# Altium schematic sheet [3] ADC.SchDoc
size A4; DocumentNumber: 4; SheetNumber: 4; SheetTotal: 4
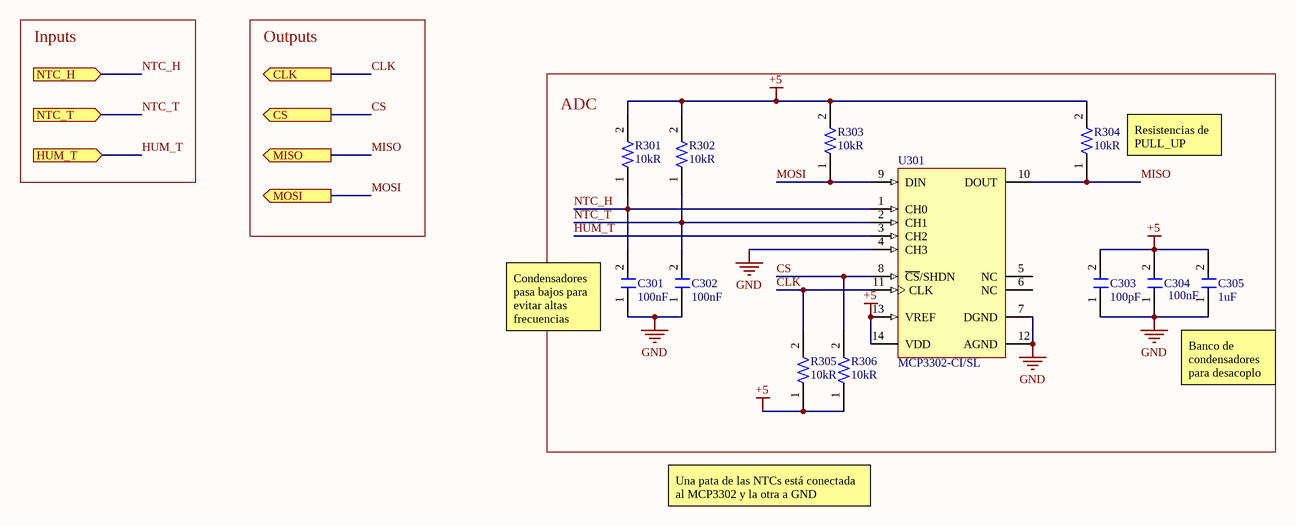
[diagram p0: [3] ADC.SchDoc]

## Parts
C301  Capacitance: 100nF  [C1206FNPC-RW]  (hidden comment: 885012208058)
C302  Capacitance: 100nF  [C1206FNPC-RW]  (hidden comment: 885012208058)
C303  Capacitance: 100pF  [C0805FNPC-W]  (hidden comment: 885012007057)
C304  Capacitance: 100nF  [C1206FNPC-RW]  (hidden comment: 885012208058)
C305  Capacitance: 1uF  [C1206FNPC-RW]  (hidden comment: 885012208036)
R301  Resistance: 10kR  [R1206FTK-W]  (hidden comment: CRCW120610K0FKEA)
R302  Resistance: 10kR  [R1206FTK-W]  (hidden comment: CRCW120610K0FKEA)
R303  Resistance: 10kR  [R1206FTK-W]  (hidden comment: CRCW120610K0FKEA)
R304  Resistance: 10kR  [R1206FTK-W]  (hidden comment: CRCW120610K0FKEA)
R305  Resistance: 10kR  [R1206FTK-W]  (hidden comment: CRCW120610K0FKEA)
R306  Resistance: 10kR  [R1206FTK-W]  (hidden comment: CRCW120610K0FKEA)
U301  MCP3302-CI/SL  [SOIC-SL14_L]

## Blocks framed on the sheet
ADC: C301-C305 R301-R306 U301

## Ports
CLK (out, see AD_info[3B]), CS (out, see AD_info[3B]), HUM_T (in, see AD_info[3B]), MISO (out, see AD_info[3B]), MOSI (out, see AD_info[3B]), NTC_H (in, see AD_info[3B]), NTC_T (in, see AD_info[3B])

## Nets
+5: C303.2 C304.2 C305.2 R301.2 R302.2 R303.2 R304.2 R305.1 R306.1 U301.13(VREF) U301.14(VDD)
GND: C301.1 C302.1 C303.1 C304.1 C305.1 U301.4(CH3) U301.7(DGND) U301.12(AGND)
CLK: R305.2 U301.11(CLK) ; port CLK
CS: R306.2 U301.8(~{CS}/SHDN) ; port CS
HUM_T: U301.3(CH2) ; port HUM_T
MISO: R304.1 U301.10(DOUT) ; port MISO
MOSI: R303.1 U301.9(DIN) ; port MOSI
NTC_H: C301.2 R301.1 U301.1(CH0) ; port NTC_H
NTC_T: C302.2 R302.1 U301.2(CH1) ; port NTC_T

Not connected (* = marked no-connect by the designer): U301 5(NC) 6(NC)

## Notes on the sheet
- Inputs
- Outputs
- (near R304) Resistencias de PULL_UP
- (near C301) Condensadores pasa bajos para evitar altas frecuencias
- Banco de condensadores para desacoplo
- Una pata de las NTCs está conectada al MCP3302 y la otra a GND

## Library data of the parts
C301 C302 C304 = C100n-25V-1206FNPC-X7R: Cap Cer 0.1UF 25V X7R 1206; Manufacturer: Wurth Electronics; Tolerance: 10%; .Creator: DO; Category: Capacitor; ComponentLink1Description: Datasheet; ComponentLink1URL: https://www.we-online.com/catalog/datasheet/885012208058.pdf; ComponentLink2Description: Where buy it; ComponentLink2URL: https://www.we-online.com/catalog/en/WCAP-CSGP-25VDC#885012208058; Supplier 1: Digi-Key; Manufacturer Part Number: 885012208058; RoHS: Yes; Stock 1: 4375; Pricing 1: 1=0,11000, 10=0,10100, 100=0,09100, 500=0,08000 (USD); Mount: Surface Mount; Case/Package: 1206; Case Code (Metric): 3216; Case Code (Imperial): 1206; Min Operating Temperature: -55°C; Max Operating Temperature: 125°C; Packaging: Tape and Reel; Voltage Rating: 25V; Length: 0.126inch; Width: 0.063inch; Thickness: 0.035inch; RoHS Compliant: Yes; ComponentLink3URL: https://katalog.we-online.de/pbs/datasheet/885012208058.pdf?src-supplier=Digi-Key; ComponentLink3Description: https://katalog.we-online.de/pbs/datasheet/885012208058.pdf?src-supplier=Digi-Key; Supplier Part Number 1: 732-8109-1-ND
C303 = C100p-50V-0805FNPC-C0G/NP0: Multilayer Ceramic Capacitor, Wcap-Csgp Series, 100 Pf, 5%, C0G / Np0, 50 V, 0805 [2012 Metric] Rohs Compliant: Yes; Manufacturer: Wurth Electronics; Voltage Rating: 50V; .Creator: DR; Supplier 1: RSComponents; Manufacturer Part Number: 885012007057; RoHS: Yes; Category: Ceramic Capacitors; Stock 1: 1; Pricing 1: 4000=0,03900, 12000=0,03800 (USD); Mount: Surface Mount; Case/Package: 0805; Case Code (Metric): 2012; Case Code (Imperial): 0805; Min Operating Temperature: -55°C; Max Operating Temperature: 125°C; Packaging: Cut Tape; Dielectric: C0G; Tolerance: 5%; Voltage Rating (DC): 50V; Length: 0.079inch; Width: 0.049inch; Thickness: 0.035inch; REACH SVHC: Unknown; RoHS Compliant: Yes; ComponentLink1URL: http://www.farnell.com/datasheets/1958443.pdf?src-supplier=Farnell; ComponentLink1Description: http://www.farnell.com/datasheets/1958443.pdf?src-supplier=Farnell; ComponentLink2URL: https://katalog.we-online.de/pbs/datasheet/885012007057.pdf?src-supplier=Digi-Key; ComponentLink2Description: https://katalog.we-online.de/pbs/datasheet/885012007057.pdf?src-supplier=Digi-Key; ComponentLink3URL: http://www.farnell.com/datasheets/1958443.pdf?src-supplier=Element14; ComponentLink3Description: http://www.farnell.com/datasheets/1958443.pdf?src-supplier=Element14; ComponentLink4URL: http://www.farnell.com/datasheets/1958443.pdf?src-supplier=Newark; ComponentLink4Description: http://www.farnell.com/datasheets/1958443.pdf?src-supplier=Newark; ComponentLink5Description: Where buy it; ComponentLink5URL: https://www.we-online.com/catalog/en/WCAP-CSGP-50VDC#885012007057; Supplier Part Number 1: 1813930
C305 = C1u-16V-1206FNPC-X7R: Cap Cer 1UF 16V X7R 1206; Manufacturer: Wurth Electronics; Tolerance: 10%; .Creator: GP; Category: Capacitor; ComponentLink1Description: Datasheet; ComponentLink1URL: https://www.we-online.com/catalog/datasheet/885012208036.pdf; ComponentLink2Description: Where buy it; ComponentLink2URL: https://www.we-online.com/catalog/en/WCAP-CSGP-16VDC#885012208036; Supplier 1: Mouser; Manufacturer Part Number: 885012208036; RoHS: Yes; Stock 1: 5938; Pricing 1: 1=0,15000, 10=0,13900, 50=0,13900, 100=0,12400, 500=0,11000, 1000=0,11000, 3000=0,09100, 10000=0,09100 (USD); Mount: Surface Mount; Case/Package: 1206; Case Code (Metric): 3216; Case Code (Imperial): 1206; Min Operating Temperature: -55°C; Max Operating Temperature: 125°C; Packaging: Tape and Reel; Voltage Rating: 16V; Length: 0.126inch; Width: 0.063inch; Thickness: 0.051inch; RoHS Compliant: Yes; Supplier Part Number 1: 710-885012208036
R301-R306 = R10k-1206FTK: Res Thick Film 1206 10K Ohm 1% 0.25W(1/4W) +/-100ppm/ßC Pad SMD Automotive T/R; Temperature Coefficient: 100ppm/°C; Voltage Rating: 200V; .Creator: GP; Category: Resistor; ComponentLink1Description: Datasheet; ComponentLink1URL: https://docs.rs-online.com/bca8/A700000006404581.pdf; ComponentLink2Description: Where buy it; ComponentLink2URL: https://es.rs-online.com/web/p/resistencias-de-montaje-en-superficie/6791765; Supplier 1: Allied Electronics; Case/Package: 1206; Number of Pins: 2; Contact Plating: Tin; Weight: 0.000353oz; Case Code (Metric): 3216; Case Code (Imperial): 1206; Package Shape: Rectangular; Size Code: 1206; Terminal Finish: Tin; Resistor Type: Thick Film; Package Quantity: 10; Number of Terminations: 2; Termination: SMD/SMT; Voltage Rating (DC): 200V; Features: Automotive AEC-Q200; Series: CRCW; Construction: Rectangular; Resistance Tolerance: 1%; Working Voltage: 200V; Length: 3.2mm; Width: 0.063inch; Height: 0.55mm; Depth: 1.6mm; Radiation Hardening: No; Lead Free: Lead Free; RoHS Compliant: Yes; REACH SVHC: Unknown; Military Standard: Not; Supplier Part Number 1: 70201262
U301 = CMP-031-00009-1: ADC, Successive Approximation, 13-Bit, 1 Func, 4 Channel, Serial Access, PDSO14; RoHS Compliant: Yes; Case/Package: SOP; Max Operating Temperature: 85°C; Min Operating Temperature: -40°C; Pins: 14